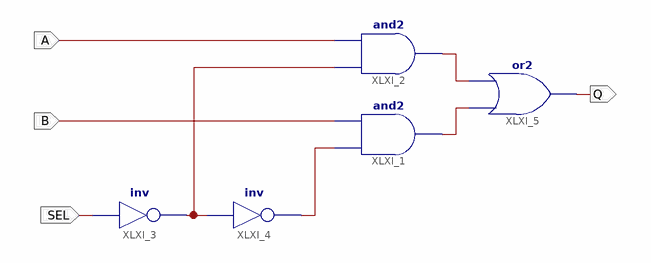
[diagram p0: schematic sheet 1]
// Xilinx ISE schematic data_selector.sch (spartan3a) as structural Verilog: 5 symbols, 4 ports
module data_selector (
  input  SEL,
  input  A,
  input  B,
  output Q
);

  wire XLXN_5, XLXN_6, XLXN_7, XLXN_8;

  and XLXI_1 (XLXN_6, XLXN_5, B);
  and XLXI_2 (XLXN_7, XLXN_8, A);
  not XLXI_3 (XLXN_8, SEL);
  not XLXI_4 (XLXN_5, XLXN_8);
  or XLXI_5 (Q, XLXN_6, XLXN_7);
endmodule
